# Altium schematic sheet TOP.SchDoc: {Наименование}
size 420 x 297 mm; ApprovedBy: {Утвердил}; CheckedBy: {Проверил}; DrawnBy: {Разраб.}; SheetNumber: 1; Scale: {Мш.}; PageSetup: Record=PageOptions|CenterHorizontal=False|CenterVertical=False|PrintScale=0.95|XCorrection=0.00|YCorrection=0.00|PrintKind=1|BorderSize=5000000|LeftOffset=0|BottomOffset=0|Orientation=1|PaperLength=1000|PaperWidth=1000|Scale=100|PaperSource=15|PrintQuality=600|MediaType=1|DitherType=10|PaperKind=A4|PrintScaleMode=1; ProcessInspection: {Т.контр.}; Mass: {М.}; NormInspection: {Н.контр.}; Letter1Column: {}; Letter2Column: {}; Letter3Column: {}; DocumentType: {Документ}; Rule: PcbType=ProtelPcb
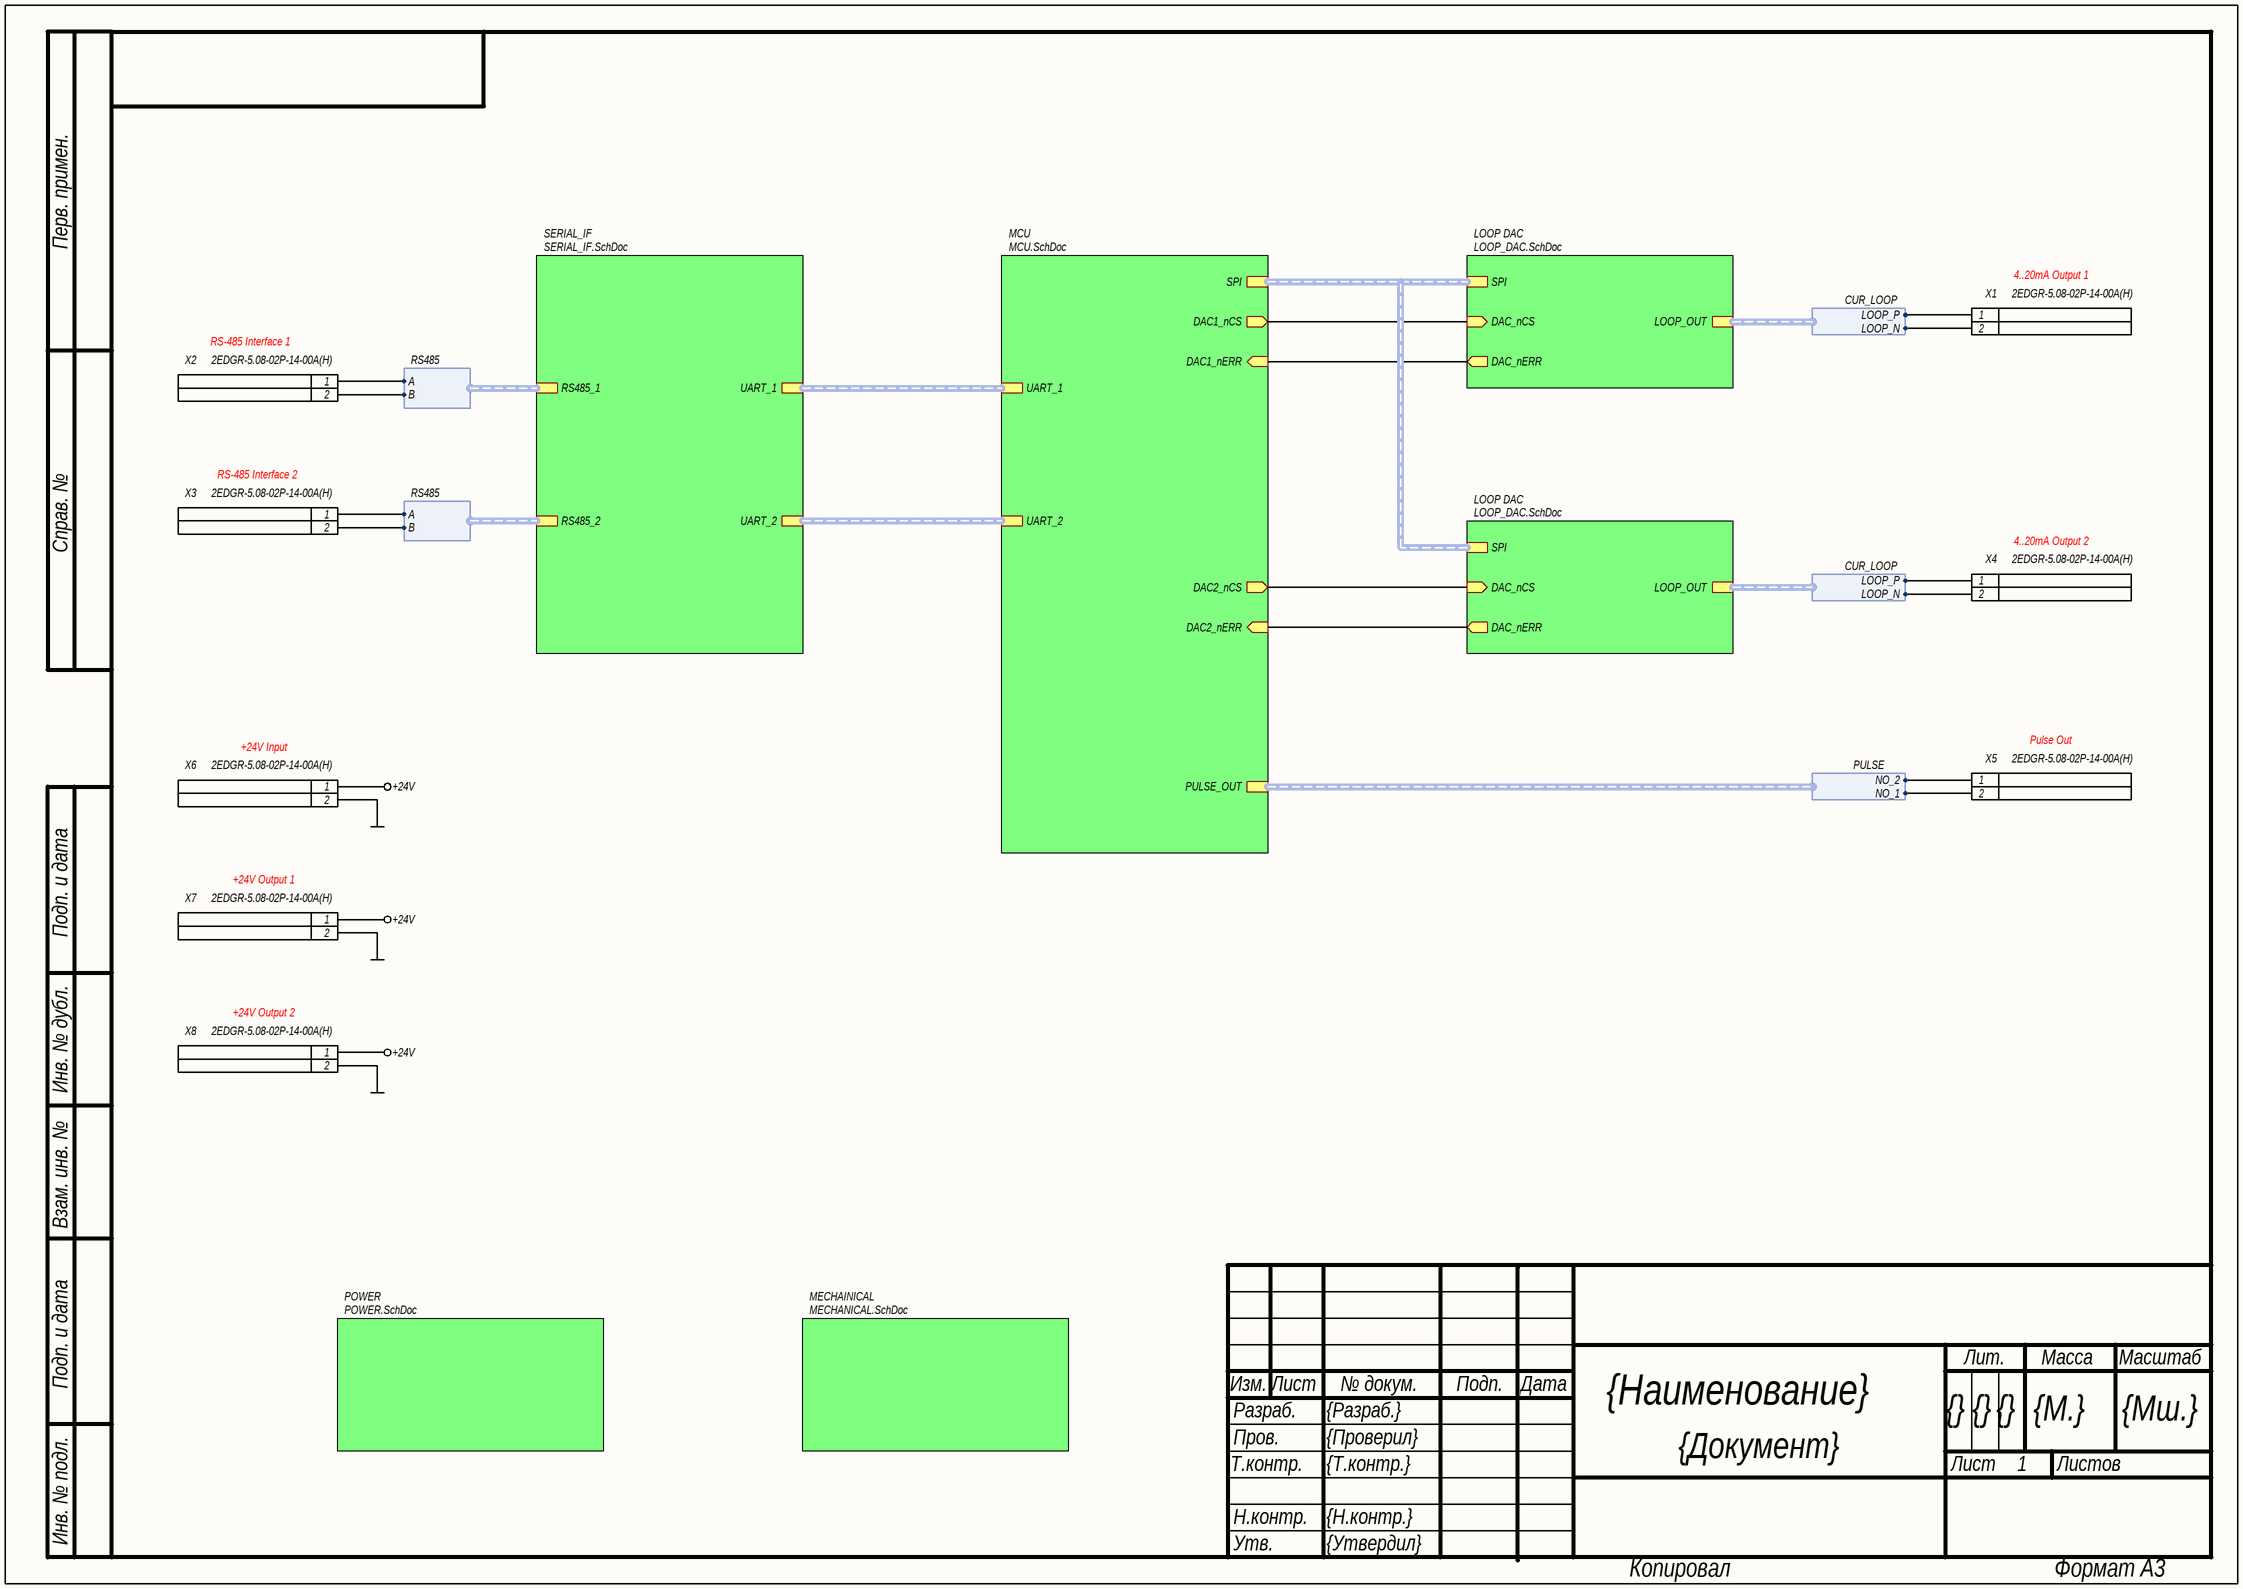
[diagram p0: TOP.SchDoc]

## Parts
X1  2EDGR-5.08-02P-14-00A(H)  [2EDGR-5.08-02P-14-00A(H)]
X2  2EDGR-5.08-02P-14-00A(H)  [2EDGR-5.08-02P-14-00A(H)]
X3  2EDGR-5.08-02P-14-00A(H)  [2EDGR-5.08-02P-14-00A(H)]
X4  2EDGR-5.08-02P-14-00A(H)  [2EDGR-5.08-02P-14-00A(H)]
X5  2EDGR-5.08-02P-14-00A(H)  [2EDGR-5.08-02P-14-00A(H)]
X6  2EDGR-5.08-02P-14-00A(H)  [2EDGR-5.08-02P-14-00A(H)]
X7  2EDGR-5.08-02P-14-00A(H)  [2EDGR-5.08-02P-14-00A(H)]
X8  2EDGR-5.08-02P-14-00A(H)  [2EDGR-5.08-02P-14-00A(H)]

## Sub-sheets
LOOP DAC = LOOP_DAC.SchDoc: DAC_nCS (in), DAC_nERR (out), LOOP_OUT (harness CUR_LOOP), SPI (harness SPI)
LOOP DAC = LOOP_DAC.SchDoc: DAC_nCS (in), DAC_nERR (out), LOOP_OUT (harness CUR_LOOP), SPI (harness SPI)
MCU = MCU.SchDoc: DAC1_nERR (in), SPI (harness SPI), DAC1_nCS (out), DAC2_nCS (out), DAC2_nERR (in), UART_2 (harness UART_CTRL), PULSE_OUT (harness PULSE), UART_1 (harness UART_CTRL)
MECHAINICAL = MECHANICAL.SchDoc: no entries
POWER = POWER.SchDoc: no entries
SERIAL_IF = SERIAL_IF.SchDoc: RS485_2 (harness RS485), RS485_1 (harness RS485), UART_2 (harness UART_CTRL), UART_1 (harness UART_CTRL)

## Harnesses
CUR_LOOP: LOOP_P, LOOP_N
RS485: A, B
PULSE: NO_1, NO_2

## Nets
+24V: X6.1 X7.1 X8.1
GND: X6.2 X7.2 X8.2
NetX1_1: X1.1 ; sheet LOOP DAC/LOOP_OUT.LOOP_P
NetX1_2: X1.2 ; sheet LOOP DAC/LOOP_OUT.LOOP_N
NetX2_1: X2.1 ; sheet SERIAL_IF/RS485_1.A
NetX2_2: X2.2 ; sheet SERIAL_IF/RS485_1.B
NetX3_1: X3.1 ; sheet SERIAL_IF/RS485_2.A
NetX3_2: X3.2 ; sheet SERIAL_IF/RS485_2.B
NetX4_1: X4.1 ; sheet LOOP DAC/LOOP_OUT.LOOP_P
NetX4_2: X4.2 ; sheet LOOP DAC/LOOP_OUT.LOOP_N
NetX5_1: X5.1 ; sheet MCU/PULSE_OUT.NO_2
NetX5_2: X5.2 ; sheet MCU/PULSE_OUT.NO_1
(unnamed): sheet LOOP DAC/DAC_nCS, sheet MCU/DAC1_nCS
(unnamed): sheet LOOP DAC/DAC_nERR, sheet MCU/DAC1_nERR
(unnamed): sheet LOOP DAC/DAC_nCS, sheet MCU/DAC2_nCS
(unnamed): sheet LOOP DAC/DAC_nERR, sheet MCU/DAC2_nERR

## Buses and harness runs
harness sheet LOOP DAC/SPI = sheet MCU/SPI
harness sheet MCU/UART_1 = sheet SERIAL_IF/UART_1
harness sheet MCU/UART_2 = sheet SERIAL_IF/UART_2

## Notes on the sheet
- (near X1) 4..20mA Output 1
- (near X2) RS-485 Interface 1
- (near X3) RS-485 Interface 2
- (near X4) 4..20mA Output 2
- Pulse Out
- +24V Input
- (near X7) +24V Output 1
- (near X8) +24V Output 2
- Перв. примен.
- Справ. №
- Подп. и дата
- Инв. № дубл.
- Взам. инв. №
- Изм.
- Лист
- № докум.
- Подп.
- Дата
- Лит.
- Масса
- Масштаб
- Т.контр.
- Пров.
- Разраб.
- Листов
- Инв. № подл.
- Н.контр.
- Утв.
- Копировал
- Формат А3

## Library data of the parts
X1-X8 = 2EDGR-5.08-02P-14-00A(H): Разъем, 2 контакта; Тип разъема: Pluggable terminal block; Количество контактов: 2; Шаг контактов: 5.08mm; Ток: 20A; Напряжение: 320V; Производитель: Degson Electronics; Описание: Pluggable terminal block; 5.08m; ways: 2; angled 90; socket; male; Температурный диапазон: -40°C ~ 105°C; Вид монтажа: Through Hole; Артикул: 2EDGR-5.08-02P-14-00A(H); Строка для документации: https://static.chipdip.ru/lib/044/DOC013044846.pdf; Тип элемента: Разъем